# Altium schematic sheet LD39050PU33R.SchDoc
size A4
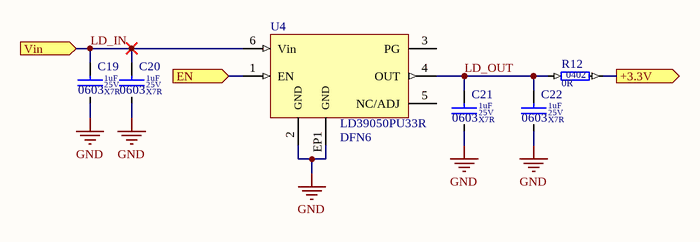
[diagram p0: LD39050PU33R.SchDoc]

## Parts
C19  value 1uF  Dielectric: X7R  Voltage: 25V  SCH_Footprint: 0603  [C_0603_1608]  (hidden comment: Ceramic X7R)
C20  value 1uF  Dielectric: X7R  Voltage: 25V  SCH_Footprint: 0603  [C_0603_1608]  (hidden comment: Ceramic X7R)
C21  value 1uF  Dielectric: X7R  Voltage: 25V  SCH_Footprint: 0603  [C_0603_1608]  (hidden comment: Ceramic X7R)
C22  value 1uF  Dielectric: X7R  Voltage: 25V  SCH_Footprint: 0603  [C_0603_1608]  (hidden comment: Ceramic X7R)
R12  value 0R  SCH_Footprint: 0402  [R_0402_1005]  (hidden comment: Resistor)
U4  SCH_Footprint: DFN6  [DFN6_3x3]  (hidden comment: LD39050PU33R)

## Ports
+3.3V (out), EN (in), Vin (in)

## Nets
GND: C19.2 C20.2 C21.2 C22.2 U4.2(GND) U4.EP1(GND)
+3.3V: R12.2 ; port +3.3V
EN: U4.1(EN) ; port EN
LD_IN: C19.1 C20.1 U4.6(Vin) ; port Vin
LD_OUT: C21.1 C22.1 R12.1 U4.4(OUT)

Not connected (* = marked no-connect by the designer): U4 3(PG) 5(NC/ADJ)

## Library data of the parts
C19-C22 = C_1uF_25V_X7R_0603_10: Capacitor; Manufacturer: Samsung; Manufacturer Part Number: CL10B105KA8NNNC; Tolerance (%): 10; Part Number: C_1uF_25V_X7R_0603_10; HelpURL: http://www.tme.eu/pl/Document/4a42202b32dab16128fe107dd69598cc/samsung-chip-cap.pdf; Supplier 1: TME; Supplier Part Number 1: CL10B105KA8NNNC; Supplier 2: RS Components; Supplier 3: Farnell; Supplier 4: Mouser; Supplier 5: Digi-Key
R12 = R_0R_0402_5: Manufacturer: Yageo; Manufacturer Part Number: RC0402JR-070RL; Voltage: 50V; Power: 63mW; Tolerance: 5%; Part Number: R_0R_0402_5; HelpURL: https://datasheet.octopart.com/RC0402JR-070RL-Yageo-datasheet-10408619.pdf; Supplier 1: TME; Supplier Part Number 1: RC0402JR-070R; Supplier 2: RS Components; Supplier Part Number 2: 6185804; Supplier 3: Farnell; Supplier Part Number 3: 9232516; Supplier 4: Mouser; Supplier Part Number 4: 603-RC0402JR-070RL; Supplier 5: Digi-Key; Supplier Part Number 5: 311-0.0JRCT-ND; Supplier 6: LCSC; Supplier Part Number 6: C60485
U4 = VL_LD39050PU33R: Manufacturer: STMicroelectronics; Voltage: 3.3V; Current: 500mA; Value: LD39050PU33R; Part Number: VL_LD39050PU33R; HelpURL: https://www.tme.eu/pl/Document/062513da0f421ddb82a14a498f7bf1c8/LD39050.pdf; Manufacturer Part Number: LD39050PU33R; Supplier 1: TME; Supplier Part Number 1: LD39050PU33R; Supplier 2: RS Components; Supplier 3: Farnell; Supplier Part Number 3: 2762703; Supplier 4: Mouser; Supplier Part Number 4: 511-LD39050PU33R; Supplier 5: Digi-Key; Supplier Part Number 5: 497-8716-1-ND